# EAGLE design BTEMS (EAGLE 7.3.0)
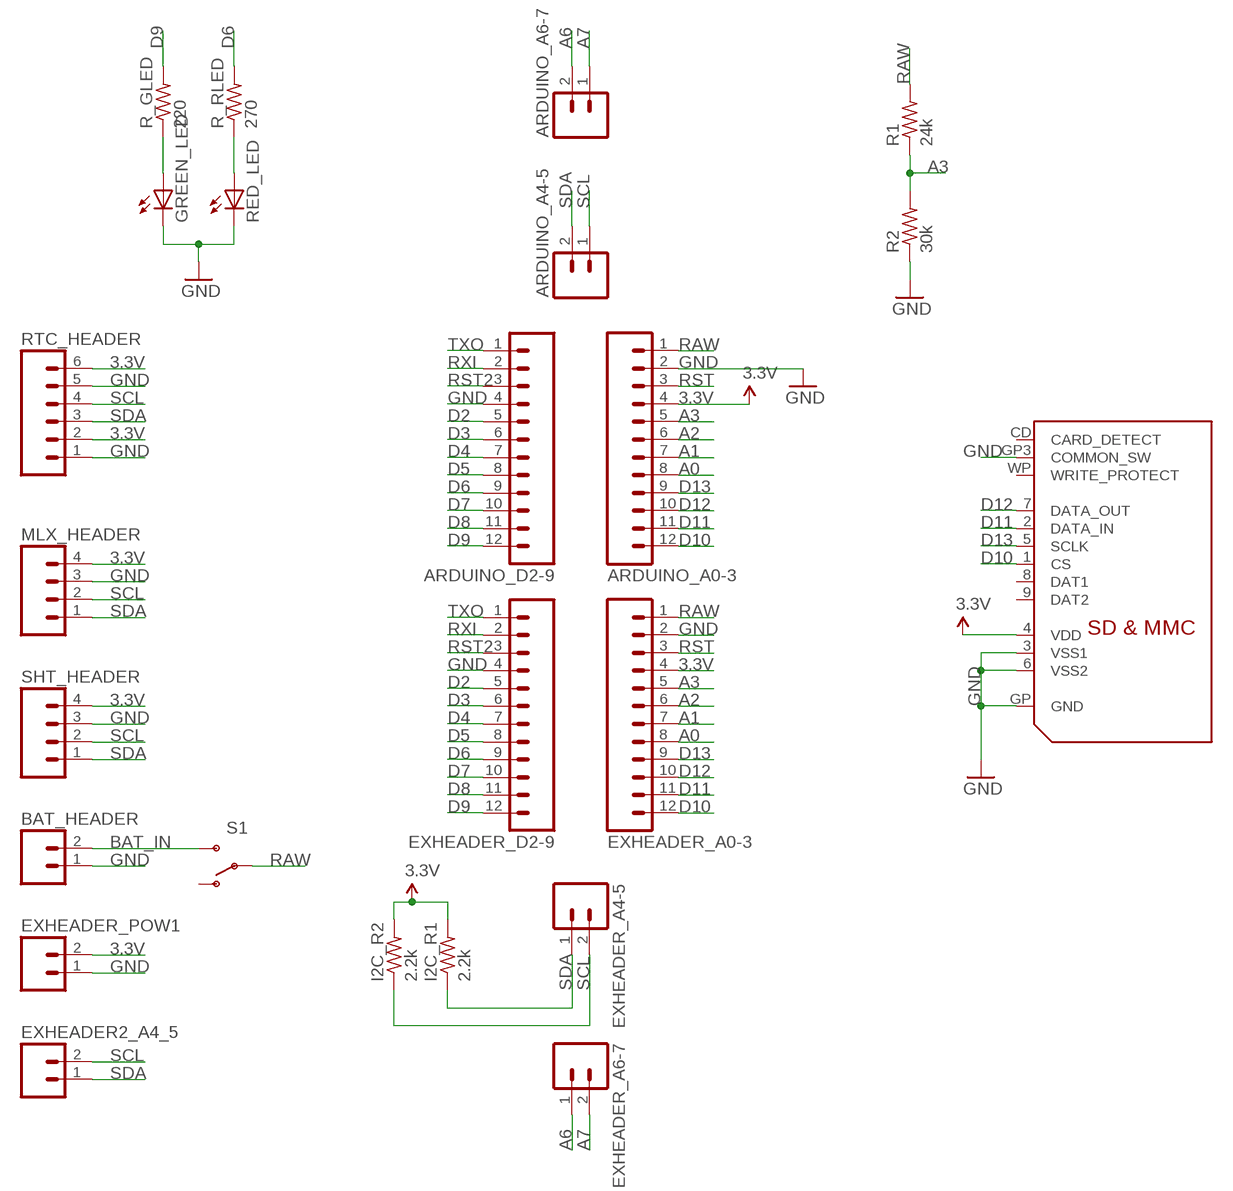
[diagram p0: schematic, sheet 1]

## Parts
ARDUINO_A0-3  M12LOCK  [1X12_LOCK]
ARDUINO_A4-5  M02PTH  [1X02]
ARDUINO_A6-7  M02PTH  [1X02]
ARDUINO_D2-9  M12LOCK  [1X12_LOCK]
BAT_HEADER  M023.5MM  [SCREWTERMINAL-3.5MM-2]
EXHEADER2_A4_5  M02PTH  [1X02]
EXHEADER_A0-3  M12PTH  [1X12]
EXHEADER_A4-5  M02LOCK  [1X02_LOCK]
EXHEADER_A6-7  M02LOCK  [1X02_LOCK]
EXHEADER_D2-9  M12PTH  [1X12]
EXHEADER_POW1  M02PTH  [1X02]
GREEN_LED  LED3MM  [LED3MM]
I2C_R1  2.2k  R-US_0207/7  [0207/7]
I2C_R2  2.2k  R-US_0207/7  [0207/7]
MLX_HEADER  M04LOCK  [1X04_LOCK]
R1  24k  R-US_0207/7  [0207/7]
R2  30k  R-US_0207/7  [0207/7]
R_GLED  220  R-US_0207/7  [0207/7]
R_RLED  270  R-US_0207/7  [0207/7]
RED_LED  LED3MM  [LED3MM]
RTC_HEADER  M06FEMALE_LOCK  [1X06_FEMALE_LOCK.010]
S1  SWITCH-SPDTPTH  [SWITCH-SPDT]
SDSLOT  SDMMC06132  [06132]
SHT_HEADER  M04LOCK  [1X04_LOCK]

## Nets
3.3V: ARDUINO_A0-3.4 EXHEADER_A0-3.4 EXHEADER_POW1.2 I2C_R1.2 I2C_R2.2 MLX_HEADER.4 RTC_HEADER.2 RTC_HEADER.6 SDSLOT.4(VDD) SHT_HEADER.4
A0: ARDUINO_A0-3.8 EXHEADER_A0-3.8
A1: ARDUINO_A0-3.7 EXHEADER_A0-3.7
A2: ARDUINO_A0-3.6 EXHEADER_A0-3.6
A3: ARDUINO_A0-3.5 EXHEADER_A0-3.5 R1.1 R2.2
A6: ARDUINO_A6-7.2 EXHEADER_A6-7.1
A7: ARDUINO_A6-7.1 EXHEADER_A6-7.2
BAT_IN: BAT_HEADER.2 S1.3(S)
D2: ARDUINO_D2-9.5 EXHEADER_D2-9.5
D3: ARDUINO_D2-9.6 EXHEADER_D2-9.6
D4: ARDUINO_D2-9.7 EXHEADER_D2-9.7
D5: ARDUINO_D2-9.8 EXHEADER_D2-9.8
D6: ARDUINO_D2-9.9 EXHEADER_D2-9.9 R_RLED.2
D7: ARDUINO_D2-9.10 EXHEADER_D2-9.10
D8: ARDUINO_D2-9.11 EXHEADER_D2-9.11
D9: ARDUINO_D2-9.12 EXHEADER_D2-9.12 R_GLED.2
D10: ARDUINO_A0-3.12 EXHEADER_A0-3.12 SDSLOT.1(CS)
D11: ARDUINO_A0-3.11 EXHEADER_A0-3.11 SDSLOT.2(DATA_IN)
D12: ARDUINO_A0-3.10 EXHEADER_A0-3.10 SDSLOT.7(DATA_OUT)
D13: ARDUINO_A0-3.9 EXHEADER_A0-3.9 SDSLOT.5(SCLK)
GND: ARDUINO_A0-3.2 ARDUINO_D2-9.4 BAT_HEADER.1 EXHEADER_A0-3.2 EXHEADER_D2-9.4 EXHEADER_POW1.1 GREEN_LED.K(C) MLX_HEADER.3 R2.1 RED_LED.K(C) RTC_HEADER.1 RTC_HEADER.5 SDSLOT.3(VSS1) SDSLOT.6(VSS2) SDSLOT.GP3(COMMON_SW) SDSLOT.GP(GND) SHT_HEADER.3
N$2: GREEN_LED.A R_GLED.1
N$3: R_RLED.1 RED_LED.A
RAW: ARDUINO_A0-3.1 EXHEADER_A0-3.1 R1.2 S1.2(P)
RST: ARDUINO_A0-3.3 EXHEADER_A0-3.3
RST2: ARDUINO_D2-9.3 EXHEADER_D2-9.3
RXI: ARDUINO_D2-9.2 EXHEADER_D2-9.2
SCL: ARDUINO_A4-5.1 EXHEADER2_A4_5.2 EXHEADER_A4-5.2 I2C_R2.1 MLX_HEADER.2 RTC_HEADER.4 SHT_HEADER.2
SDA: ARDUINO_A4-5.2 EXHEADER2_A4_5.1 EXHEADER_A4-5.1 I2C_R1.1 MLX_HEADER.1 RTC_HEADER.3 SHT_HEADER.1
TXO: ARDUINO_D2-9.1 EXHEADER_D2-9.1
Unconnected: S1.1(O) SDSLOT.8(DAT1) SDSLOT.9(DAT2) SDSLOT.CD(CARD_DETECT) SDSLOT.WP(WRITE_PROTECT)

## Library data of the parts
ARDUINO_A0-3 ARDUINO_D2-9 EXHEADER_A0-3 EXHEADER_D2-9 = SparkFun-Connectors:M12: Header 12 Standard 12-pin 0.1" header. Use with straight break away headers (SKU : PRT-00116), right angle break away headers (PRT-00553), swiss pins (PRT-00743), machine pins (PRT-00117), and female headers (PRT-00115).
ARDUINO_A4-5 ARDUINO_A6-7 EXHEADER2_A4_5 EXHEADER_A4-5 EXHEADER_A6-7 EXHEADER_POW1 = SparkFun-Connectors:M02: Standard 2-pin 0.1" header. Use with - straight break away headers ( PRT-00116) - right angle break away headers (PRT-00553) - swiss pins (PRT-00743) - machine pins (PRT-00117) - female headers (PRT-00115) Molex polarized connector foot print use with: PRT-08233 with associated crimp pins and housings. 2.54_SCREWTERM for use with PRT-10571. 3.5mm Screw Terminal footprints for PRT-08084 5mm Screw Terminal footprints for use with PRT-08432
BAT_HEADER = SparkFun-Connectors:M02: Standard 2-pin 0.1" header. Use with - straight break away headers ( PRT-00116) - right angle break away headers (PRT-00553) - swiss pins (PRT-00743) - machine pins (PRT-00117) - female headers (PRT-00115) Molex polarized connector foot print use with: PRT-08233 with associated crimp pins and housings. 2.54_SCREWTERM for use with PRT-10571. 3.5mm Screw Terminal footprints for PRT-08084 5mm Screw Terminal footprints for use with PRT-08432; PROD_ID: CONN-08399
GREEN_LED RED_LED = adafruit:LED: LED OSRAM: - CHIPLED LG R971, LG N971, LY N971, LG Q971, LY Q971, LO R971, LY R971 LH N974, LH R974 LS Q976, LO Q976, LY Q976 LO Q996 - Hyper CHIPLED LW Q18S LB Q993, LB Q99A, LB R99A - SideLED LS A670, LO A670, LY A670, LG A670, LP A670 LB A673, LV A673, LT A673, LW A673 LH A674 LY A675 LS A676, LA A676, LO A676, LY A676, LW A676 LS A679, LY A679, LG A679 - Hyper Micro SIDELED® LS Y876, LA Y876, LO Y876, LY Y876 LT Y87S - SmartLED LW L88C, LW L88S LB L89C, LB L89S, LG L890 LS L89K, LO L89K, LY L89K LS L896, LA L896, LO L896, LY L896 - TOPLED LS T670, LO T670, LY T670, LG T670, LP T670 LSG T670, LSP T670, LSY T670, LOP T670, LYG T670 LG T671, LOG T671, LSG T671 LB T673, LV T673, LT T673, LW T673 LH T674 LS T676, LA T676, LO T676, LY T676, LB T676, LH T676, LSB T676, LW T676 LB T67C, LV T67C, LT T67C, LS T67K, LO T67K, LY T67K, LW E67C LS E67B, LA E67B, LO E67B, LY E67B, LB E67C, LV E67C, LT E67C LW T67C LS T679, LY T679, LG T679 LS T770, LO T770, LY T770, LG T770, LP T770 LB T773, LV T773, LT T773, LW T773 LH T774 LS E675, LA E675, LY E675, LS T675 LS T776, LA T776, LO T776, LY T776, LB T776 LHGB T686 LT T68C, LB T68C - Hyper Mini TOPLED® LB M676 - Mini TOPLED Santana® LG M470 LS M47K, LO M47K, LY M47K Source: http://www.osram.convergy.de/
I2C_R1 I2C_R2 R1 R2 R_GLED R_RLED = adafruit:R-US_: RESISTOR, American symbol
MLX_HEADER SHT_HEADER = SparkFun-Connectors:M04: Header 4 Standard 4-pin 0.1" header. Use with straight break away headers (SKU : PRT-00116), right angle break away headers (PRT-00553), swiss pins (PRT-00743), machine pins (PRT-00117), and female headers (PRT-00115). Molex polarized connector foot print use with SKU : PRT-08231 with associated crimp pins and housings. 1MM SMD Version SKU: PRT-10208
RTC_HEADER = SparkFun-Connectors:M06: Header 6 Standard 6-pin 0.1" header. Use with straight break away headers (SKU : PRT-00116), right angle break away headers (PRT-00553), swiss pins (PRT-00743), machine pins (PRT-00117), and female headers (PRT-00115). Molex polarized connector foot print use with SKU : PRT-08094 with associated crimp pins and housings. NOTES ON THE VARIANTS LOCK and LOCK_LONGPADS... This footprint was designed to help hold the alignment of a through-hole component (i.e. 6-pin header) while soldering it into place. You may notice that each hole has been shifted either up or down by 0.005 of an inch from it's more standard position (which is a perfectly straight line). This slight alteration caused the pins (the squares in the middle) to touch the edges of the holes. Because they are alternating, it causes a "brace" to hold the component in place. 0.005 has proven to be the perfect amount of "off-center" position when using our standard breakaway headers. Although looks a little odd when you look at the bare footprint, once you have a header in there, the alteration is very hard to notice. Also,if you push a header all the way into place, it is covered up entirely on the bottom side. This idea of altering the position of holes to aid alignment will be further integrated into the Sparkfun Library for other footprints. It can help hold any component with 3 or more connection pins.
S1 = SparkFun-Electromechanical:SWITCH-SPDT: SPDT Switch Simple slide switch, Spark Fun Electronics SKU : COM-00102 DPDT SMT slide switch, AYZ0202, SWCH-08179; PROD_ID: SWCH-08261
SDSLOT = adafruit:SDMMC: SD MMC Card holder 4UCON part #06132 - easy to solder

## Board
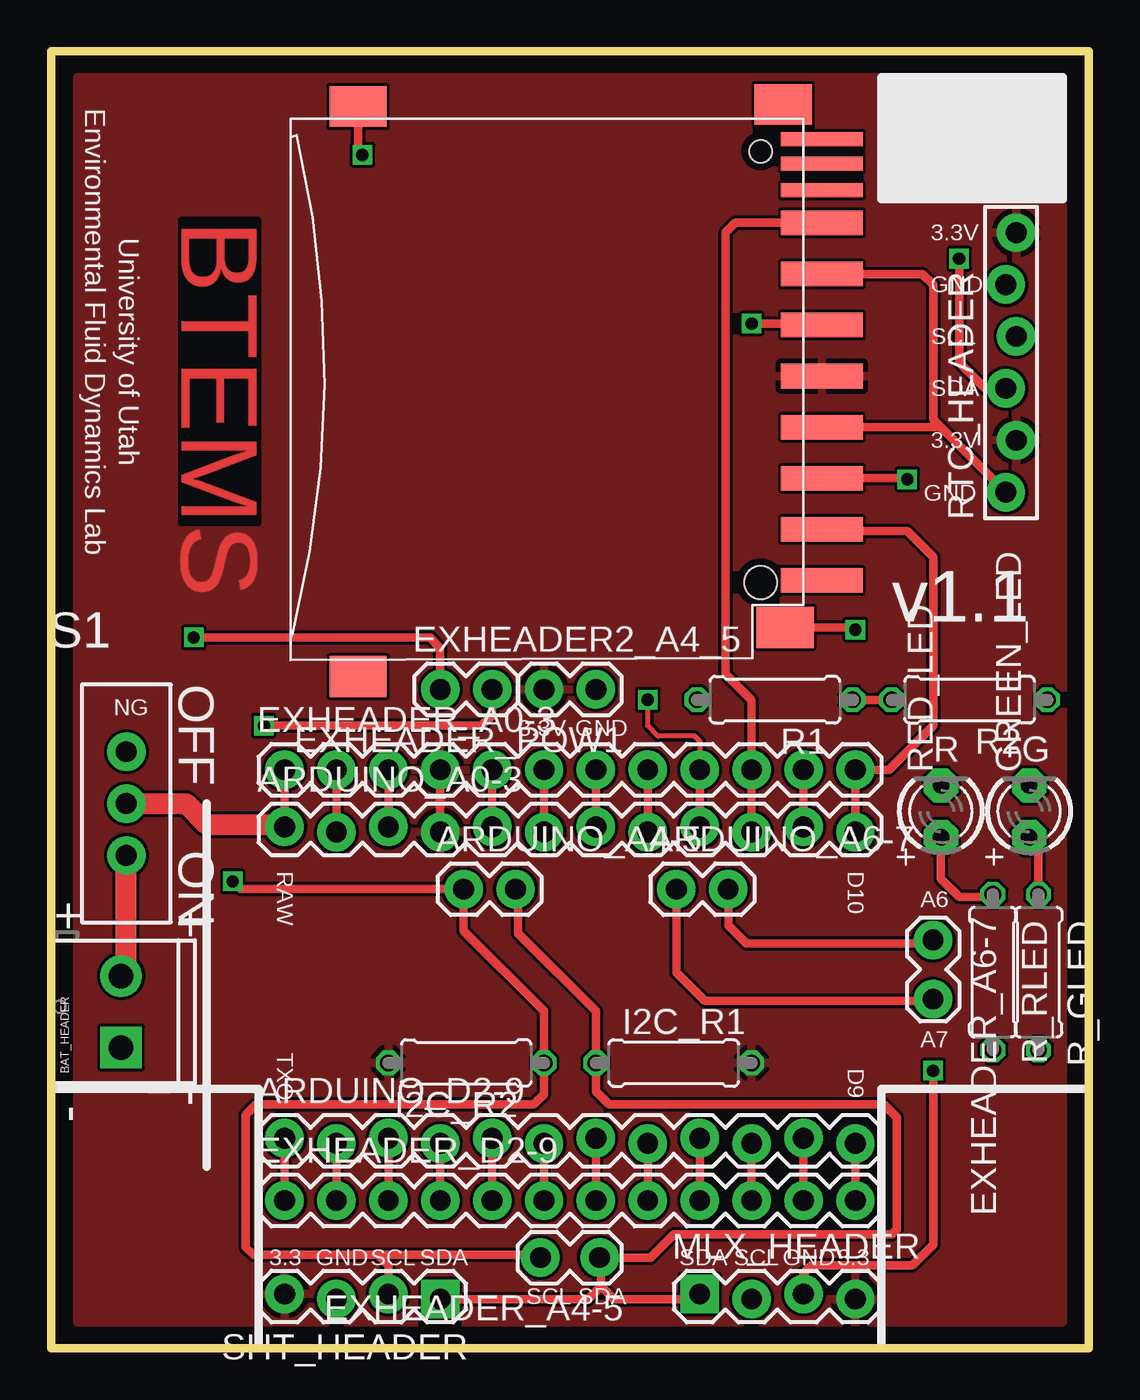
[diagram p1: board, top side]
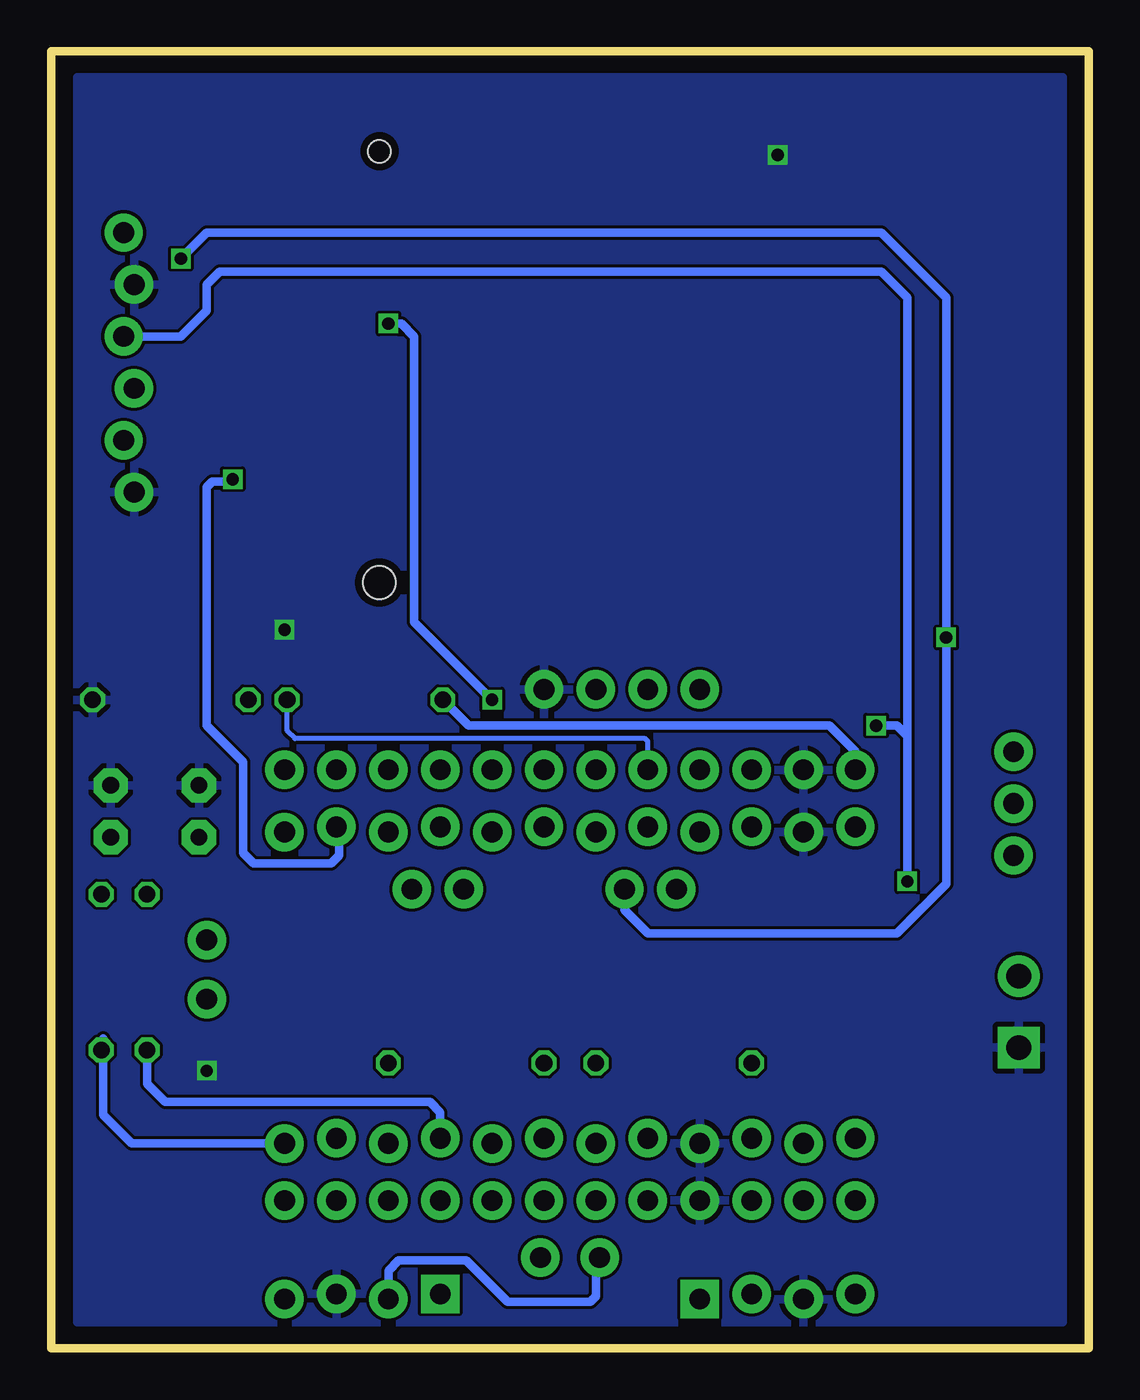
[diagram p2: board, bottom side, seen from below]

Size 50.8 x 63.5 mm. Coordinates in mm from the lower left corner, seen from the top.
Outline: 0,0 0,63.5 50.8,63.5 50.8,0 0,0
Copper layers (1*16): Top 0.0356mm / dielectric 1.5011mm / Bottom 0.0356mm
Design rules "oshpark-2layer": minimum track width 6mil, minimum drill 13mil, track to track 6mil, track to pad 6mil, pad to pad 6mil, via to via 6mil, smd to smd 6mil, copper to edge 15mil, drill to drill 6mil, minimum pad ring 7mil, minimum via ring 7mil, stop-mask expansion 2.5mil, vias tented up to drill 0mil, thermal gap 10mil

### Footprints (pad centres in the part's own frame; a part is rotated, then mirrored left to right if it is on the bottom)
1X12_LOCK = drill 1.016 pad 1.88: 1 0,0.127; 2 2.54,-0.127; 3 5.08,0.127; 4 7.62,-0.127; 5 10.16,0.127; 6 12.7,-0.127; 7 15.24,0.127; 8 17.78,-0.127; 9 20.32,0.127; 10 22.86,-0.127; 11 25.4,0.127; 12 27.94,-0.127
1X02 = drill 1.016 pad 1.88: 1 0,0; 2 2.54,0
SCREWTERMINAL-3.5MM-2 = drill 1.2 pad 2.032 square: 1 0,0 | drill 1.2 pad 2.032: 2 3.5,0
1X12 = drill 1.016 pad 1.88: 1 0,0; 2 2.54,0; 3 5.08,0; 4 7.62,0; 5 10.16,0; 6 12.7,0; 7 15.24,0; 8 17.78,0; 9 20.32,0; 10 22.86,0; 11 25.4,0; 12 27.94,0
1X02_LOCK = drill 1.016 pad 1.88: 1 -0.178,0; 2 2.718,0
LED3MM = drill 0.813 pad 1.676 octagon: A -1.27,0; K 1.27,0
0207/7 = drill 0.813 octagon: 1 -3.81,0; 2 3.81,0
1X04_LOCK = drill 1.016 pad 1.88 square: 1 0,0.127 | drill 1.016 pad 1.88: 2 2.54,-0.127; 3 5.08,0.127; 4 7.62,-0.127
1X06_FEMALE_LOCK.010 = drill 1.016 pad 1.88: 1 0,0.254; 2 2.54,-0.254; 3 5.08,0.254; 4 7.62,-0.254; 5 10.16,0.254; 6 12.7,-0.254
SWITCH-SPDT = drill 1.016 pad 1.88: 1 0,2.54; 2 0,0; 3 0,-2.54
06132 = smd 1.2 x 4: 1 6.9,0.9; 2 4.4,0.9; 3 1.9,0.9; 4 -0.6,0.9; 5 -3.1,0.9; 6 -5.6,0.9; 7 -8.1,0.9; 9 9.4,0.9 | smd 0.7 x 4: 8 -9.7,0.9; CD -11,0.9; WP -12.2,0.9 | smd 2 x 2.8: GP -13.8,-21.8; GP2 14.1,-21.8; GP3 11.7,-0.9; GP4 -13.9,-1 | hole 1.1: -11.6,-2.1 | hole 1.6: 9.5,-2.1

### Placement (x,y rotation side)
ARDUINO_A0-3  11.43,25.4 0 top
ARDUINO_A4-5  20.19,22.48 0 top
ARDUINO_A6-7  30.61,22.48 0 top
ARDUINO_D2-9  11.43,10.16 0 top
BAT_HEADER  3.43,14.73 90 top
EXHEADER2_A4_5  19.05,32.26 0 top
EXHEADER_A0-3  11.43,28.32 0 top
EXHEADER_A4-5  26.67,4.45 180 top
EXHEADER_A6-7  43.18,19.81 270 top
EXHEADER_D2-9  11.43,7.24 0 top
EXHEADER_POW1  26.67,32.26 180 top
GREEN_LED  47.88,26.29 90 top
I2C_R1  30.48,13.97 0 top
I2C_R2  20.32,13.97 180 top
MLX_HEADER  31.75,2.54 0 top
R1  35.43,31.75 180 top
R2  44.96,31.75 180 top
R_GLED  48.34,18.41 270 top
R_RLED  46.1,18.41 270 top
RED_LED  43.56,26.29 90 top
RTC_HEADER  46.99,41.91 90 top
S1  3.68,26.67 0 top
SDSLOT  36.83,46.99 270 top
SHT_HEADER  19.05,2.54 180 top

### Tracks (layer width: path | path; a pad name or v marks a point on that pad's centre or on a via)
3.3V
  Top 0.406: ARDUINO_A0-3.4 EXHEADER_A0-3.4
  pour Top: 1.27,1.27 49.53,1.27 49.53,62.23 1.27,62.23
A0
  Top 0.406: ARDUINO_A0-3.8 EXHEADER_A0-3.8
A1
  Top 0.406: ARDUINO_A0-3.7 EXHEADER_A0-3.7
A2
  Top 0.406: ARDUINO_A0-3.6 EXHEADER_A0-3.6
A3
  Top 0.406: ARDUINO_A0-3.5 EXHEADER_A0-3.5 | R1.1 R2.2
  Bottom 0.254: EXHEADER_A0-3.5 21.59,29.72 21.72,29.84 38.86,29.84 39.24,30.23 R1.1
A6
  Top 0.406: ARDUINO_A6-7.2 33.15,20.7 34.04,19.81 43,19.81 EXHEADER_A6-7.1
A7
  Top 0.406: ARDUINO_A6-7.1 30.61,18.41 32,17.02 43.1,17.02 EXHEADER_A6-7.2
BAT_IN
  Top 1.016: BAT_HEADER.2 3.68,18.23 S1.3
D2
  Top 0.406: EXHEADER_D2-9.5 ARDUINO_D2-9.5
D3
  Top 0.406: EXHEADER_D2-9.6 ARDUINO_D2-9.6
D4
  Top 0.406: ARDUINO_D2-9.7 EXHEADER_D2-9.7
D5
  Top 0.406: ARDUINO_D2-9.8 EXHEADER_D2-9.8
D6
  Top 0.406: EXHEADER_D2-9.9 ARDUINO_D2-9.9
  Bottom 0.406: R_RLED.2 46.1,12.95 45.21,12.06 32.26,12.06 31.75,11.56 ARDUINO_D2-9.9
D7
  Top 0.406: EXHEADER_D2-9.10 ARDUINO_D2-9.10
D8
  Top 0.406: EXHEADER_D2-9.11 ARDUINO_D2-9.11
D9
  Top 0.406: EXHEADER_D2-9.12 ARDUINO_D2-9.12
  Bottom 0.406: ARDUINO_D2-9.12 46.86,10.03 48.26,11.43 48.26,15.16 R_GLED.2
D10
  Top 0.406: ARDUINO_A0-3.12 EXHEADER_A0-3.12 41.02,28.32 43.18,30.48 43.18,38.73 41.91,40.01 37.81,40.01 SDSLOT.1
D11  (via drill 0.6)
  Top 0.406: ARDUINO_A0-3.11 EXHEADER_A0-3.11 | SDSLOT.2 41.87,42.59 v41.91,42.55
  Bottom 0.406: ARDUINO_A0-3.11 36.7,25.4 36.7,24.13 37.08,23.75 40.89,23.75 41.4,24.26 41.4,28.7 43.18,30.48 43.18,42.16 42.93,42.42 42.04,42.42 v41.91,42.55
D12
  Top 0.406: ARDUINO_A0-3.10 EXHEADER_A0-3.10 34.29,31.75 33.02,33.02 33.02,54.61 33.5,55.09 SDSLOT.7
D13  (via drill 0.6)
  Top 0.254: v29.21,31.75 29.21,30.48 29.72,29.97 31.5,29.97 31.75,29.72 EXHEADER_A0-3.9
  Top 0.406: ARDUINO_A0-3.9 EXHEADER_A0-3.9 | SDSLOT.5 37.66,50.16 v34.29,50.16
  Bottom 0.406: v34.29,50.16 33.66,50.16 33.02,49.53 33.02,35.56 v29.21,31.75
GND  (via drill 0.6)
  Top 0.406: ARDUINO_A0-3.2 EXHEADER_A0-3.2 | EXHEADER_D2-9.4 ARDUINO_D2-9.4 | SDSLOT.3 43.56,45.09 | 43.56,45.09 RTC_HEADER.1 | SDSLOT.6 42.66,52.59 43.18,52.07 43.18,45.47 43.56,45.09 | SDSLOT.GP 15.03,58.63 v15.24,58.42 | MLX_HEADER.3 36.83,3.68 37.21,4.06 42.16,4.06 43.18,5.08 v43.18,13.59 | SDSLOT.GP3 39.37,35.29 v39.37,35.18
  pour Bottom: 1.27,62.23 49.53,62.23 49.53,1.27 1.27,1.27
N$2
  Top 0.406: R_GLED.1 48.34,24.56 GREEN_LED.A
N$3
  Top 0.406: RED_LED.A 43.56,22.99 44.45,22.1 45.97,22.1 R_RLED.1
RAW
  Top 0.406: ARDUINO_A0-3.1 EXHEADER_A0-3.1
  Top 1.016: S1.2 6.6,26.67 7.62,25.65 11.3,25.65 ARDUINO_A0-3.1
  Bottom 0.406: EXHEADER_A0-3.1 11.43,29.21 12.7,30.48 30.35,30.48 R1.2
RST
  Top 0.406: ARDUINO_A0-3.3 EXHEADER_A0-3.3
RST2
  Top 0.406: EXHEADER_D2-9.3 ARDUINO_D2-9.3
RXI
  Top 0.406: EXHEADER_D2-9.2 ARDUINO_D2-9.2
SCL  (via drill 0.6)
  Top 0.406: v8.89,22.86 9.27,22.48 ARDUINO_A4-5.1 20.19,20.45 24.13,16.51 I2C_R2.1 24.13,12.45 23.62,11.94 10.03,11.94 9.53,11.43 9.53,4.95 9.91,4.57 16,4.57 | 16,4.57 23.82,4.57 EXHEADER_A4-5.2 | SHT_HEADER.2 16.51,4.06 16,4.57 | EXHEADER2_A4_5.2 21.59,30.99 21.08,30.48 v10.41,30.48
  Bottom 0.406: v8.89,22.86 8.89,29.97 | 8.89,29.97 8.89,51.44 10.16,52.7 42.55,52.7 43.18,52.07 43.18,50.8 44.45,49.53 RTC_HEADER.4 | v10.41,30.48 9.4,30.48 8.89,29.97 | MLX_HEADER.2 34.29,3.81 33.78,4.32 30.48,4.32 28.45,2.29 24.38,2.29 24.13,2.54 24.13,4.27 EXHEADER_A4-5.2
SDA  (via drill 0.6)
  Top 0.406: ARDUINO_A4-5.2 22.86,22.35 22.86,20.32 26.67,16.51 I2C_R1.1 26.67,12.57 27.3,11.94 40.77,11.94 41.4,11.3 41.4,5.84 41.15,5.59 30.48,5.59 29.34,4.45 EXHEADER_A4-5.1 26.92,4.37 26.92,3.05 | v44.45,53.34 44.45,48.26 45.72,46.99 RTC_HEADER.3 | SHT_HEADER.1 26.29,2.41 26.92,3.05 | EXHEADER2_A4_5.1 19.05,34.29 18.54,34.8 v6.99,34.8 | 26.92,3.05 27.56,2.41 31.5,2.41 MLX_HEADER.1
  Bottom 0.406: ARDUINO_A4-5.2 22.73,21.46 21.59,20.32 9.4,20.32 6.99,22.73 v6.99,34.8 6.99,51.44 10.16,54.61 43.18,54.61 v44.45,53.34
TXO
  Top 0.406: EXHEADER_D2-9.1 ARDUINO_D2-9.1

### Text on the board
Top: BTEMS
tPlace: Environmental Fluid Dynamics Lab | University of Utah | 3.3V | GND | SCL | SDA | 3.3V | GND | v1.1 | OFF | NG | 3.3V | GND | R | G | ON | RAW | D10 | A6 | + | + | A7 | TXO | D9 | - | - | 3.3 | GND | SCL | SDA | SDA | SCL | GND | 3.3 | SCL | SDA
tValues: SDA | SCL
tStop: BTEMS